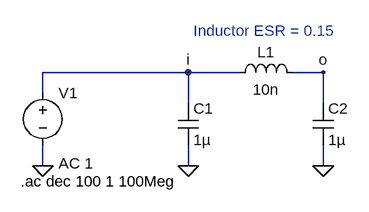
[diagram p0: schematic Pi_Filter.asc]
Pi_Filter.asc, the LTspice schematic file:
Version 4
SHEET 1 880 680
WIRE 64 96 -160 96
WIRE 144 96 64 96
WIRE 272 96 224 96
WIRE -160 128 -160 96
WIRE 64 144 64 96
WIRE 272 144 272 96
WIRE -160 240 -160 208
WIRE 64 240 64 208
WIRE 272 240 272 208
FLAG 64 240 0
FLAG 272 240 0
FLAG -160 240 0
FLAG 272 96 o
FLAG 64 96 i
SYMBOL cap 48 144 R0
SYMATTR InstName C1
SYMATTR Value 1µ
SYMBOL cap 256 144 R0
SYMATTR InstName C2
SYMATTR Value 1µ
SYMBOL ind 128 112 R270
WINDOW 0 32 56 VTop 2
WINDOW 3 5 56 VBottom 2
SYMATTR InstName L1
SYMATTR Value 10n
SYMATTR SpiceLine Rser=0.15
SYMBOL voltage -160 112 R0
WINDOW 123 24 124 Left 2
WINDOW 39 0 0 Left 0
SYMATTR InstName V1
SYMATTR Value ""
SYMATTR Value2 AC 1
TEXT -194 264 Left 2 !.ac dec 100 1 100Meg
TEXT 72 32 Left 2 ;Inductor ESR = 0.15

The netlist it stands for:
* Pi_Filter.asc
C1 i 0 1µ
C2 o 0 1µ
L1 i o 10n Rser=0.15
V1 i 0 AC 1
.ac dec 100 1 100Meg
* Inductor ESR = 0.15
.backanno
.end

* Results of the author's LTspice run, read from the files saved beside the schematic
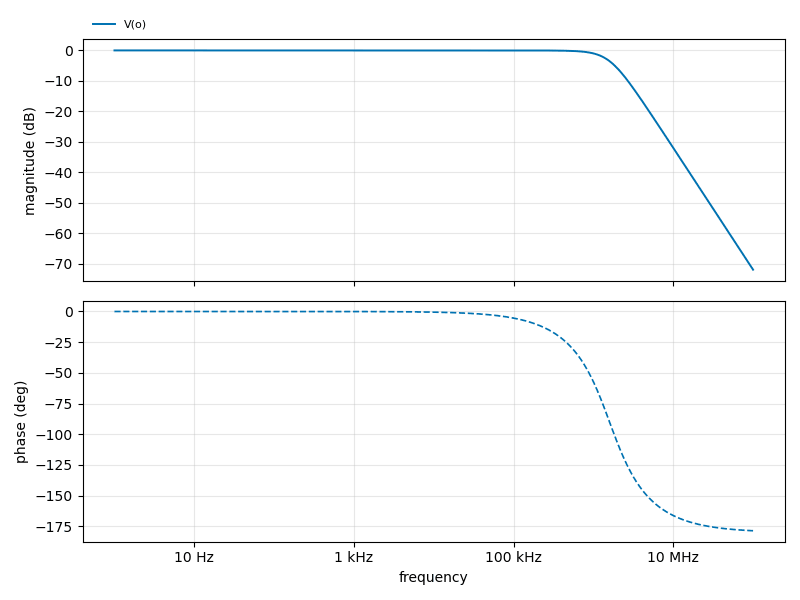
[diagram p1: AC Analysis of Pi_Filter.asc, plotted from the saved traces]
* AC Analysis, 1 run:
*   V(o): -0.00 dB at 1 Hz, -71.93 dB at 100 MHz, peak -0.00 dB at 1 Hz, 3 dB below the peak at 1.495 MHz